# Altium schematic sheet bolid-iso-protium.SchDoc
size A3
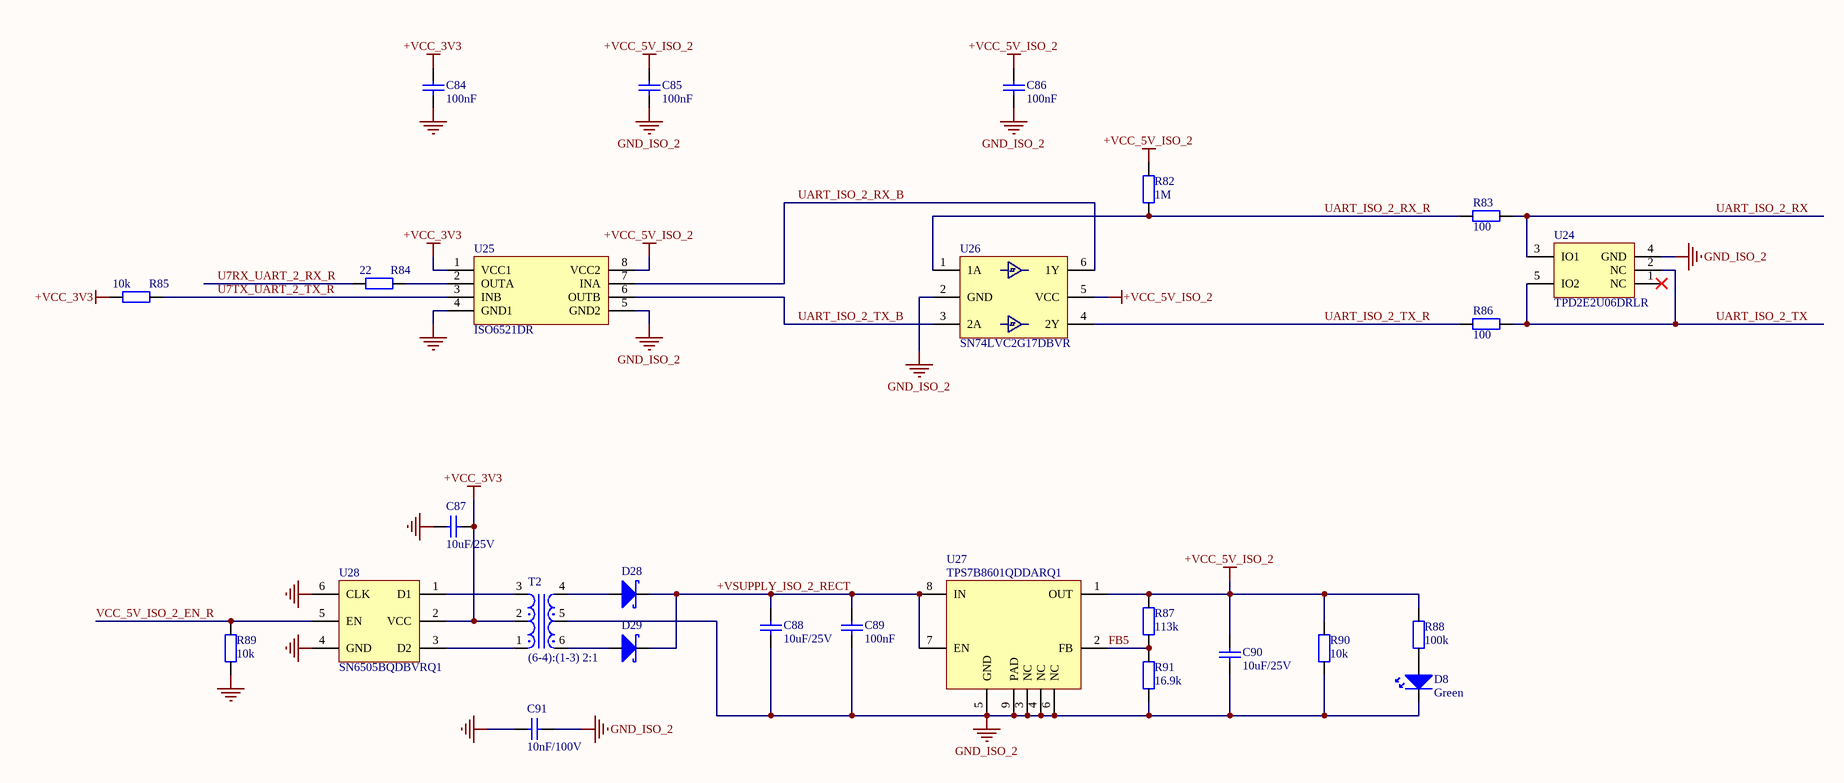
[diagram p0: bolid-iso-protium.SchDoc]

## Parts
C84  Value Displayed: 100nF  [C0402-CAPC100X50X55L22 - Tayio Yuden TDK]  (hidden comment: GRM155R71H104KE14D)
C85  Value Displayed: 100nF  [C0402-CAPC100X50X55L22 - Tayio Yuden TDK]  (hidden comment: GRM155R71H104KE14D)
C86  Value Displayed: 100nF  [C0402-CAPC100X50X55L22 - Tayio Yuden TDK]  (hidden comment: GRM155R71H104KE14D)
C87  Value Displayed: 10uF/25V  [C1206-CAPC320X160X190L65N - Murata]  (hidden comment: TMK316AB7106KL-T)
C88  Value Displayed: 10uF/25V  [C1206-CAPC320X160X190L65N - Murata]  (hidden comment: TMK316AB7106KL-T)
C89  Value Displayed: 100nF  [C0402-CAPC100X50X55L22 - Tayio Yuden TDK]  (hidden comment: GRM155R71H104KE14D)
C90  Value Displayed: 10uF/25V  [C1206-CAPC320X160X190L65N - Murata]  (hidden comment: TMK316AB7106KL-T)
C91  Value Displayed: 10nF/100V  [C0603-CAPC162X80X95L35N]  (hidden comment: GRM188R72A103KA01J)
D8  Illumination Color: Green  [D0603 DIONC166X84X36L42N Littelfuse]  (hidden comment: 150060GS75000)
D28  MBR0530T3G  [SOD-123-2L SOD375X160X128L32X60N - Fairchild]  (value not drawn)
D29  MBR0530T3G  [SOD-123-2L SOD375X160X128L32X60N - Fairchild]  (value not drawn)
R82  value 1M  [R0402-RESC100X50X40L22N]  (hidden comment: AC0402FR-071ML)
R83  value 100  [R0402-RESC100X50X40L22N]  (hidden comment: RC0402FR-07100RL)
R84  value 22  [R0402-RESC100X50X40L22N]  (hidden comment: RC0402FR-1322RL)
R85  value 10k  [R0402-RESC100X50X40L22N]  (hidden comment: RC0402FR-0710KL)
R86  value 100  [R0402-RESC100X50X40L22N]  (hidden comment: RC0402FR-07100RL)
R87  value 113k  [R0402-RESC100X50X40L22N]  (hidden comment: RC0402FR-07113KL)
R88  value 100k  [R0402-RESC100X50X40L22N]  (hidden comment: RC0402FR-07100KL)
R89  value 10k  [R0402-RESC100X50X40L22N]  (hidden comment: RC0402FR-0710KL)
R90  value 10k  [R0402-RESC100X50X40L22N]  (hidden comment: RC0402FR-0710KL)
R91  value 16.9k  [R0402-RESC100X50X40L22N]  (hidden comment: RC0402FR-0716K9L)
T2  value (6-4):(1-3) 2:1  [WE 760390014]  (hidden comment: 760390015)
U24  TPD2E2U06DRLR  [TI SOT-5X3 DRL0005A SOTFL50P160X60-5N]
U25  ISO6521DR  [TI SOIC8 D0008A SOIC8P127_490X599X175L84X41N]
U26  SN74LVC2G17DBVR  [TI SOT23 DBV0006A SOT23-6P95_280X145L45X37N]
U27  TPS7B8601QDDARQ1  [TI SOIC8 DDA0008E-C01 SOIC127P600X170_HS-9N]
U28  SN6505BQDBVRQ1  [TI SOT23 DBV0006A SOT23-6P95_280X145L45X37N]

## Nets
+VCC_3V3: C84.2 C87.2 R85.2 T2.2 U25.1(VCC1) U28.2(VCC)
+VCC_5V_ISO_2: C85.2 C86.2 C90.2 R82.2 R87.2 R88.2 R90.2 U25.8(VCC2) U26.5(VCC) U27.1(OUT)
GND: C84.1 C87.1 C91.1 R89.1 U25.4(GND1) U28.4(GND) U28.6(CLK)
GND_ISO_2: C85.1 C86.1 C88.1 C89.1 C90.1 C91.2 D8.1(K) R90.1 R91.1 T2.5 U24.4(GND) U25.5(GND2) U26.2(GND) U27.3(NC) U27.4(NC) U27.5(GND) U27.6(NC) U27.9(PAD)
+VSUPPLY_ISO_2_RECT: C88.2 C89.2 D28.1(K) D29.1(K) U27.7(EN) U27.8(IN)
FB5: R87.1 R91.2 U27.2(FB)
U7RX_UART_2_RX_R: R84.1
U7TX_UART_2_TX_R: R85.1 U25.3(INB)
UART_ISO_2_RX: R83.2 U24.3(IO1)
UART_ISO_2_RX_B: U25.7(INA) U26.6(1Y)
UART_ISO_2_RX_R: R82.1 R83.1 U26.1(1A)
UART_ISO_2_TX: R86.2 U24.2(NC) U24.5(IO2)
UART_ISO_2_TX_B: U25.6(OUTB) U26.3(2A)
UART_ISO_2_TX_R: R86.1 U26.4(2Y)
VCC_5V_ISO_2_EN_R: R89.2 U28.5(EN)
NetD8_2: D8.2(A) R88.1
NetD28_2: D28.2(A) T2.4
NetD29_2: D29.2(A) T2.6
NetR84_2: R84.2 U25.2(OUTA)
NetT2_1: T2.1 U28.3(D2)
NetT2_3: T2.3 U28.1(D1)

Not connected (* = marked no-connect by the designer): U24 1(NC)*

## Library data of the parts
C84-C86 C89 = GRM155R71H104KE14D: MLCC 0402 (1005) 100nF 10% 50V X7R; Manufacturer: Murata Electronics; Capacitance: 0.1 uF; Type: Chip Multilayer Ceramic Capacitor for General Purpose; Voltage Rating DC: 50 VDC; Capacitance - pF: 100000 pF; Class: Class 2; Supplier 1: Mouser; Manufacturer Part Number: GRM155R71H104KE14D; RoHS: RoHS Compliant; Category: Multilayer Ceramic Capacitors MLCC - SMD/SMT; Stock 1: 3511637; Pricing 1: 1=0.090, 10=0.038, 100=0.016, 500=0.012, 1000=0.009, 2500=0.008, 5000=0.007, 10000=0.005 (EUR); Height: 0.5 mm; Length: 1 mm; Package / Case: 0402 (1005 metric); Packaging: Cut Tape; Product: General Type MLCCs; Series: GRM; Termination Style: SMD/SMT; Tolerance: 10 %; Width: 0.5 mm; Brand: Murata Electronics; Capacitance - nF: 100 nF; Case Code - in: 0402; Case Code - mm: 1005; Dielectric: X7R; Maximum Operating Temperature: + 125 C; Minimum Operating Temperature: - 55 C; Product Type: Ceramic Capacitors; Standard Pack Qty: 10000; Subcategory: Capacitors; Termination: Standard; RoHS - Mouser: Y; Minimum Order Quantity: 1; Reeling: True; ComponentLink1URL: https://www.mouser.com/datasheet/2/281/murata_03052018_GRM_Series_1-1310166.pdf; ComponentLink1Description: https://www.mouser.com/datasheet/2/281/murata_03052018_GRM_Series_1-1310166.pdf; Value: 100nF; Supplier Part Number 1: 81-GRM155R71H104KE4D
C87 C88 C90 = TMK316AB7106KL-T: MLCC 1206 (3216) 10uF 10% 25V X7R; Manufacturer: Taiyo Yuden; Type: General Purpose; Voltage Rating DC: 25 VDC; Class: Class 2; Value: 10u; Supplier 1: Mouser; Manufacturer Part Number: TMK316AB7106KL-T; RoHS: RoHS Compliant; Category: Multilayer Ceramic Capacitors MLCC - SMD/SMT; Stock 1: 162457; Pricing 1: 1=0.288, 10=0.130, 100=0.087, 500=0.077, 1000=0.068, 2000=0.056 (EUR); Capacitance: 10 uF; Diameter: -; Height: 1.6 mm; Length: 3.2 mm; Package / Case: 1206 (3216 metric); Packaging: Cut Tape; Product: General Type MLCCs; Series: M; Termination Style: SMD/SMT; Tolerance: 10 %; Width: 1.6 mm; Brand: Taiyo Yuden; Case Code - in: 1206; Case Code - mm: 3216; Dielectric: X7R; Maximum Operating Temperature: + 125 C; Minimum Operating Temperature: - 55 C; Product Type: Ceramic Capacitors; Standard Pack Qty: 2000; Subcategory: Capacitors; Termination: Standard; RoHS - Mouser: Y; Minimum Order Quantity: 1; Reeling: True; ComponentLink1URL: https://www.mouser.com/datasheet/2/396/mlcc02_e-1307760.pdf; ComponentLink1Description: https://www.mouser.com/datasheet/2/396/mlcc02_e-1307760.pdf; Supplier Part Number 1: 963-TMK316AB7106KL-T
C91 = GRM188R72A103KA01J: MLCC 0603 (1608) 10nF 10% 100V X7R; Manufacturer: Murata Electronics; Capacitance: 0.01 uF; Type: Chip Multilayer Ceramic Capacitor for General Purpose; Voltage Rating DC: 100 VDC; Capacitance - pF: 10000 pF; Class: Class 2; Value: 10n; Supplier 1: Mouser; Manufacturer Part Number: GRM188R72A103KA01J; RoHS: RoHS Compliant; Category: Multilayer Ceramic Capacitors MLCC - SMD/SMT; Stock 1: 161253; Pricing 1: 1=0.085, 10=0.049, 100=0.021, 500=0.015, 1000=0.011, 5000=0.010, 10000=0.008, 20000=0.007 (EUR); Height: 0.8 mm; Length: 1.6 mm; Package / Case: 0603 (1608 metric); Packaging: Cut Tape; Product: General Type MLCCs; Series: GRM; Termination Style: SMD/SMT; Tolerance: 10 %; Width: 0.8 mm; Brand: Murata Electronics; Capacitance - nF: 10 nF; Case Code - in: 0603; Case Code - mm: 1608; Dielectric: X7R; Maximum Operating Temperature: + 125 C; Minimum Operating Temperature: - 55 C; Product Type: Ceramic Capacitors; Standard Pack Qty: 10000; Subcategory: Capacitors; Termination: Standard; RoHS - Mouser: Y; Minimum Order Quantity: 1; Reeling: True; ComponentLink1URL: https://www.mouser.com/datasheet/2/281/1/GRM188R72A103KA01_01A-1985966.pdf; ComponentLink1Description: https://www.mouser.com/datasheet/2/281/1/GRM188R72A103KA01_01A-1985966.pdf; Supplier Part Number 1: 81-GRM188R72A103KA1J
D8 = 150060GS75000: LED 0603 (1608) Green; Manufacturer: Wurth Elektronik; Lens Color/Style: Water Clear; Power Rating: 105 mW; Lens Shape: Rectangular; Luminous Intensity: 430 mcd; Peak Wavelength: 515 nm; Viewing Angle: 140 deg; If - Forward Current: 20 mA; Vf - Forward Voltage: 3.2 V; Vr - Reverse Voltage: 5 V; Wavelength/Color Temperature: 520 nm; Supplier 1: Mouser; Manufacturer Part Number: 150060GS75000; RoHS: RoHS Compliant; Category: Standard LEDs - SMD; Stock 1: 17312; Pricing 1: 1=0.130, 10=0.126, 50=0.115, 100=0.099, 500=0.085, 4000=0.085 (EUR); Height: 0.7 mm; Length: 1.6 mm; Package / Case: 0603 (1608 metric); Packaging: Cut Tape; Product: Green LEDs; Series: WL-SMCW; Width: 0.8 mm; Brand: Wurth Elektronik; Mounting Style: SMD/SMT; Lens Dimensions: 1.1 mm x 0.8 mm; Lens Transparency: Water Clear; Maximum Operating Temperature: + 85 C; Minimum Operating Temperature: - 40 C; Moisture Sensitive: Yes; Product Type: LED - Standard; Standard Pack Qty: 4000; Subcategory: LEDs; RoHS - Mouser: Y; Minimum Order Quantity: 1; Reeling: True; ComponentLink1URL: https://www.mouser.com/datasheet/2/445/150060GS75000-368921.pdf; ComponentLink1Description: https://www.mouser.com/datasheet/2/445/150060GS75000-368921.pdf; Supplier Part Number 1: 710-150060GS75000
D28 D29 = MBR0530T3G: ON Semi MBR0530T3G; SMT Schottky Diode; 30V 500mA; 2-Pin SOD-123; Manufacturer: ON Semiconductor; Supplier 1: Mouser; Manufacturer Part Number: MBR0530T3G; RoHS: Yes; Category: Schottky Diodes; Stock 1: 167531; Pricing 1: 1=0,19, 10=0,126, 50=0,126, 100=0,065, 1000=0,053, 10000=0,041 (USD); ComponentLink1URL: https://datasheet.ciiva.com/6381/mbr0530t1-d-6381904.pdf?src-supplier=Digikey; ComponentLink1Description: https://datasheet.ciiva.com/6381/mbr0530t1-d-6381904.pdf?src-supplier=Digikey; ComponentLink2URL: https://datasheet.ciiva.com/7962/85890-7962703.pdf?src-supplier=Element14; ComponentLink2Description: https://datasheet.ciiva.com/7962/85890-7962703.pdf?src-supplier=Element14; ComponentLink3URL: https://datasheet.ciiva.com/8294/mbr0530t1-d-8294572.pdf?src-supplier=Avnet; ComponentLink3Description: https://datasheet.ciiva.com/8294/mbr0530t1-d-8294572.pdf?src-supplier=Avnet; ComponentLink4URL: https://datasheet.ciiva.com/15144/getdatasheetpartid-86762-15144599.pdf?src-supplier=Verical; ComponentLink4Description: https://datasheet.ciiva.com/15144/getdatasheetpartid-86762-15144599.pdf?src-supplier=Verical; ComponentLink5URL: https://datasheet.ciiva.com/6381/mbr0530t1-d-6381902.pdf?src-supplier=Digikey; ComponentLink5Description: https://datasheet.ciiva.com/6381/mbr0530t1-d-6381902.pdf?src-supplier=Digikey; Supplier Part Number 1: 863-MBR0530T3G
R82 = AC0402FR-071ML: RES 0402 (1005) 1.00M 1% 0.0625W 50V Thick Film; Manufacturer: YAGEO; Power Rating: 62.5 mW (1/16 W); Resistance: 1 MOhms; Temperature Coefficient: 100 PPM / C; Qualification: AEC-Q200; Supplier 1: Mouser; Manufacturer Part Number: AC0402FR-071ML; RoHS: RoHS Compliant By Exemption; Category: Thick Film Resistors - SMD; Stock 1: 142366; Pricing 1: 1=0.085, 10=0.019, 100=0.008, 1000=0.004, 2500=0.003, 10000=0.003 (EUR); Application: Automotive Grade; Height: 0.32 mm; Length: 1 mm; Packaging: Cut Tape; Product: Thick Film Resistors General Purpose; Series: AC; Technology: Thick Film; Termination Style: SMD/SMT; Tolerance: 1 %; Type: General Purpose Resistor; Voltage Rating: 50 V; Width: 0.5 mm; Brand: YAGEO; Mounting Style: PCB Mount; Case Code - in: 0402; Case Code - mm: 1005; Maximum Operating Temperature: + 155 C; Minimum Operating Temperature: - 55 C; Product Type: Thick Film Resistors; Standard Pack Qty: 10000; Subcategory: Resistors; RoHS - Mouser: E; Minimum Order Quantity: 1; Reeling: True; ComponentLink1URL: https://www.mouser.com/datasheet/2/447/Yageo_PYu_AC_51_RoHS_L_7_1714230-1874691.pdf; ComponentLink1Description: https://www.mouser.com/datasheet/2/447/Yageo_PYu_AC_51_RoHS_L_7_1714230-1874691.pdf; Supplier Part Number 1: 603-AC0402FR-071ML
R83 R86 = RC0402FR-07100RL: RES 0402 (1005) 100.0 ohm 1% 0.0625W 50V Thick Film; Manufacturer: Yageo; Power Rating: 62.5 mW, 125 mW; Resistance: 100 Ohms; Temperature Coefficient: 100 PPM / C; Supplier 1: Mouser; Manufacturer Part Number: RC0402FR-07100RL; RoHS: RoHS Compliant; Category: Thick Film Resistors - SMD; Stock 1: 3714956; Pricing 1: 1=0.090, 10=0.011, 100=0.004, 1000=0.003, 10000=0.003 (EUR); Application: High Reliability; Features: -; Height: 0.35 mm; Length: 1 mm; Package / Case: -; Packaging: Cut Tape; Product: Thick Film Resistors SMD; Series: RC; Technology: Thick Film; Termination Style: SMD/SMT; Tolerance: 1 %; Type: General Purpose; Voltage Rating: 50 V; Width: 0.5 mm; Brand: Yageo; Mounting Style: PCB Mount; Case Code - in: 0402; Case Code - mm: 1005; Maximum Operating Temperature: + 155 C; Minimum Operating Temperature: - 55 C; Product Type: Thick Film Resistors; Standard Pack Qty: 10000; Subcategory: Resistors; RoHS - Mouser: Y; Minimum Order Quantity: 1; Reeling: True; ComponentLink1URL: https://www.mouser.com/datasheet/2/447/PYu-RC_Group_51_RoHS_L_10-1664068.pdf; ComponentLink1Description: https://www.mouser.com/datasheet/2/447/PYu-RC_Group_51_RoHS_L_10-1664068.pdf; Supplier Part Number 1: 603-RC0402FR-07100RL
R84 = RC0402FR-1322RL: RES 0402 (1005) 22.0 ohm 1% 0.0625W 50V Thick Film; Manufacturer: Yageo; Resistance: 22R; Power Rating: 62.5mW; Temperature Coefficient: 100ppm/°C; Supplier 1: Mouser; Manufacturer Part Number: RC0402FR-1322RL; RoHS: Yes; Category: Chip SMD Resistors; Stock 1: 130563; Pricing 1: 1=0,10000, 10=0,01200, 50=0,01200, 100=0,00500, 1000=0,00300, 10000=0,00300 (USD); Case/Package: 0402; Case Code (Imperial): 0402; Case Code (Metric): 1005; Weight: 2.3E-05oz; Contact Plating: Tin,Matte; Size Code: 0402; Min Operating Temperature: -55°C; Max Operating Temperature: 155°C; Voltage Rating: 50V; Tolerance: 1%; Packaging: Tape and Reel; Resistor Type: Thick Film; Termination: SMD/SMT; Series: RC; Length: 1mm; Width: 0.5mm; Height: 0.35mm; Radiation Hardening: No; Lead Free: Lead Free; RoHS Compliant: Yes; ComponentLink1URL: https://datasheet.ciiva.com/17423/pyu-rc0402-51-rohs-l-6-r-17423721.pdf?src-supplier=Future+Electronics; ComponentLink1Description: https://datasheet.ciiva.com/17423/pyu-rc0402-51-rohs-l-6-r-17423721.pdf?src-supplier=Future+Electronics; ComponentLink2URL: https://datasheet.ciiva.com/8890/pyu-rc0402-51-rohs-l-6-8890187.pdf?src-supplier=Avnet; ComponentLink2Description: https://datasheet.ciiva.com/8890/pyu-rc0402-51-rohs-l-6-8890187.pdf?src-supplier=Avnet; Supplier Part Number 1: 603-RC0402FR-1322RL
R85 R89 R90 = RC0402FR-0710KL: RES 0402 (1005) 10.0k 1% 0.0625W 50V Thick Film; Manufacturer: Yageo; Power Rating: 62.5 mW, 125 mW; Resistance: 10 kOhms; Temperature Coefficient: 100 PPM / C; Supplier 1: Mouser; Manufacturer Part Number: RC0402FR-0710KL; RoHS: RoHS Compliant; Category: Thick Film Resistors - SMD; Stock 1: 20942447; Pricing 1: 1=0.090, 10=0.011, 100=0.004, 1000=0.003, 10000=0.003 (EUR); Application: High Reliability; Features: -; Height: 0.35 mm; Length: 1 mm; Package / Case: -; Packaging: Cut Tape; Product: Thick Film Resistors SMD; Series: RC; Technology: Thick Film; Termination Style: SMD/SMT; Tolerance: 1 %; Type: General Purpose; Voltage Rating: 50 V; Width: 0.5 mm; Brand: Yageo; Mounting Style: PCB Mount; Case Code - in: 0402; Case Code - mm: 1005; Maximum Operating Temperature: + 155 C; Minimum Operating Temperature: - 55 C; Product Type: Thick Film Resistors; Standard Pack Qty: 10000; Subcategory: Resistors; RoHS - Mouser: Y; Minimum Order Quantity: 1; Reeling: True; ComponentLink1URL: https://www.mouser.com/datasheet/2/447/PYu-RC_Group_51_RoHS_L_10-1664068.pdf; ComponentLink1Description: https://www.mouser.com/datasheet/2/447/PYu-RC_Group_51_RoHS_L_10-1664068.pdf; Supplier Part Number 1: 603-RC0402FR-0710KL
R87 = RC0402FR-07113KL: RES 0402 (1005) 113.0k 1% 0.0625W 50V Thick Film; Manufacturer: Yageo; Supplier 1: Mouser; Manufacturer Part Number: RC0402FR-07113KL; RoHS: Yes; Category: Chip SMD Resistors; Stock 1: 42603; Pricing 1: 1=0,1, 10=0,007, 50=0,007, 100=0,004, 1000=0,003, 10000=0,002 (USD); Voltage Rating (DC): 50V; Lead Free: 5697LeadFree; ComponentLink1URL: https://datasheet.ciiva.com/16744/pyu-rc0402-51-rohs-l-6-r-16744521.pdf?src-supplier=Future+Electronics; ComponentLink1Description: https://datasheet.ciiva.com/16744/pyu-rc0402-51-rohs-l-6-r-16744521.pdf?src-supplier=Future+Electronics; ComponentLink2URL: https://datasheet.ciiva.com/2452/pyu-r-int-thick-7-2452604.pdf?src-supplier=Digikey; ComponentLink2Description: https://datasheet.ciiva.com/2452/pyu-r-int-thick-7-2452604.pdf?src-supplier=Digikey; Supplier Part Number 1: 603-RC0402FR-07113KL
R88 = RC0402FR-07100KL: RES 0402 (1005) 100.0k 1% 0.0625W 50V Thick Film; Manufacturer: Yageo; Power Rating: 62.5 mW, 125 mW; Resistance: 100 kOhms; Temperature Coefficient: 100 PPM / C; Supplier 1: Mouser; Manufacturer Part Number: RC0402FR-07100KL; RoHS: RoHS Compliant; Category: Thick Film Resistors - SMD; Stock 1: 2491111; Pricing 1: 1=0.090, 10=0.011, 100=0.004, 1000=0.003, 10000=0.003 (EUR); Application: High Reliability; Features: -; Height: 0.35 mm; Length: 1 mm; Package / Case: -; Packaging: Cut Tape; Product: Thick Film Resistors SMD; Series: RC; Technology: Thick Film; Termination Style: SMD/SMT; Tolerance: 1 %; Type: General Purpose; Voltage Rating: 50 V; Width: 0.5 mm; Brand: Yageo; Mounting Style: PCB Mount; Case Code - in: 0402; Case Code - mm: 1005; Maximum Operating Temperature: + 155 C; Minimum Operating Temperature: - 55 C; Product Type: Thick Film Resistors; Standard Pack Qty: 10000; Subcategory: Resistors; RoHS - Mouser: Y; Minimum Order Quantity: 1; Reeling: True; ComponentLink1URL: https://www.mouser.com/datasheet/2/447/PYu-RC_Group_51_RoHS_L_10-1664068.pdf; ComponentLink1Description: https://www.mouser.com/datasheet/2/447/PYu-RC_Group_51_RoHS_L_10-1664068.pdf; Supplier Part Number 1: 603-RC0402FR-07100KL
R91 = RC0402FR-0716K9L: RES 0402 (1005) 16.9k 1% 0.0625W 50V Thick Film; Manufacturer: Yageo; Resistance: 16.9kR; Power Rating: 62.5mW; Max Power Dissipation: 63mW; Temperature Coefficient: 100ppm/°C; Supplier 1: Mouser; Manufacturer Part Number: RC0402FR-0716K9L; RoHS: Yes; Category: Chip SMD Resistors; Stock 1: 109384; Pricing 1: 1=0,1, 10=0,008, 50=0,008, 100=0,005, 1000=0,005, 10000=0,002 (USD); Case/Package: 0402; Case Code (Imperial): 0402; Case Code (Metric): 1005; Contact Plating: Tin,Matte; Size Code: 0402; Min Operating Temperature: -55°C; Max Operating Temperature: 155°C; Package Quantity: 10000; Tolerance: 1%; Voltage Rating: 50V; Packaging: Tape and Reel; Number of Terminations: 2; Termination: SMD/SMT; Voltage Rating (DC): 50V; Features: Moisture Resistant; Series: RC; Length: 0.039inch; Width: 0.5mm; Height: 0.016inch; Lead Free: Lead Free; RoHS Compliant: Yes; ComponentLink1URL: https://datasheet.ciiva.com/12561/pyu-rc0402-51-rohs-l-6-r-8721-12561757.pdf?src-supplier=Mouser; ComponentLink1Description: https://datasheet.ciiva.com/12561/pyu-rc0402-51-rohs-l-6-r-8721-12561757.pdf?src-supplier=Mouser; ComponentLink2URL: https://datasheet.ciiva.com/17073/pyu-rc0402-51-rohs-l-6-r-17073310.pdf?src-supplier=Future+Electronics; ComponentLink2Description: https://datasheet.ciiva.com/17073/pyu-rc0402-51-rohs-l-6-r-17073310.pdf?src-supplier=Future+Electronics; Supplier Part Number 1: 603-RC0402FR-0716K9L
T2 = 760390015: Transformer 2:1 11VuS 150mAAC Power Transformers MID-SN6501 TI Driver Toroid .475mH 3.3VDC; Manufacturer: Wurth Elektronik / Midcom; Inductance: 475 uH; Operating Frequency: 250 kHz to 550 kHz; Power Rating: 1.8 W; Turns Ratio: 0.043055556; Type: Push-Pull; Primary Voltage Rating: 3.3 V; Secondary Current Rating: 350 mA; Secondary Voltage Rating: 5 V; Primary Winding: Dual Primary Winding; Secondary Winding: Dual Secondary Winding; Voltage Time - Et: 11 uVs; Supplier 1: Mouser; Manufacturer Part Number: 760390015; RoHS: RoHS Compliant; Category: Power Transformers; Stock 1: 4102; Pricing 1: 1=1.90, 10=1.71, 50=1.55, 100=1.42, 500=1.34, 1200=1.34 (EUR); Height: 4.19 mm; Length: 6.73 mm; Operating Temperature Range: - 40 C to + 125 C; Packaging: Cut Tape; Product: Power; Series: MID-PPTI; Termination Style: SMD/SMT; Width: 10.05 mm; Brand: Wurth Elektronik / Midcom; Mounting Style: SMD/SMT; Maximum Operating Temperature: + 125 C; Minimum Operating Temperature: - 40 C; Product Type: Audio & Signal Transformers; Standard Pack Qty: 1200; Subcategory: Transformers; RoHS - Mouser: Y; Minimum Order Quantity: 1; Reeling: True; ComponentLink1URL: https://www.mouser.com/datasheet/2/445/760390015-221218.pdf; ComponentLink1Description: https://www.mouser.com/datasheet/2/445/760390015-221218.pdf; Supplier Part Number 1: 710-760390015
U24 = TPD2E2U06DRLR: TVS DIODE 5.5VWM 12.4VC 5SOT; Manufacturer: Texas Instruments; Direction: Unidirectional; Capacitance: 1.9pF; Reverse Standoff Voltage: 5.5V; Min Breakdown Voltage: 6.5V; Clamping Voltage: 12.4V; Peak Pulse Power: 85W; Power Line Protection: Yes; Breakdown Voltage: 8.5V; Peak Pulse Current: 5.5A; Number of Channels: 2; Interface: LVDS,USB,Ethernet; Supplier 1: Mouser; Manufacturer Part Number: TPD2E2U06DRLR; RoHS: Yes; Category: Integrated Circuits (ICs); Stock 1: 73856; Pricing 1: 1=0,49, 10=0,356, 50=0,356, 100=0,254, 1000=0,173, 10000=0,159 (USD); Mount: Surface Mount; Case/Package: SOT-5; Number of Pins: 5; Min Operating Temperature: -40°C; Max Operating Temperature: 125°C; Packaging: Tape and Reel; Working Voltage: 5.5V; Polarity: Unidirectional; Termination: SMD/SMT; Package Quantity: 4000; Series: -; Operating Supply Voltage: 5.5V; Number of Unidirectional Channels: 2; Lead Free: Lead Free; RoHS Compliant: Yes; Reach SVHC Compliant: No; ComponentLink1URL: https://datasheet.ciiva.com/48533/tpd2e2u06-48533343.pdf?src-supplier=Avnet; ComponentLink1Description: https://datasheet.ciiva.com/48533/tpd2e2u06-48533343.pdf?src-supplier=Avnet; Supplier Part Number 1: 595-TPD2E2U06DRLR
U25 = ISO6521DR: Functional isolation dual-channel 1/1 digital isolator 8-SOIC -40 to 125; Manufacturer: Texas Instruments; Supplier 1: Mouser; Manufacturer Part Number: ISO6521DR; RoHS: No; Stock 1: 2524; Pricing 1: 1=1,38, 10=0,862, 50=0,862, 100=0,695, 1000=0,635, 10000=0,549 (USD); Case/Package: SOIC; Number of Pins: 8; Length: 4.9mm; Width: 3.91mm; Height: 1.75mm; Thickness: 1.58mm; Supplier Part Number 1: 595-ISO6521DR
U26 = SN74LVC2G17DBVR: 2-ch, 1.65-V to 5.5-V buffers with Schmitt-Trigger inputs 6-SOT-23 -40 to 125; Manufacturer: Texas Instruments; Number of Channels: 2; Max Supply Voltage: 5.5V; Min Supply Voltage: 1.65V; Propagation Delay: 4.3ns; Logic Function: Schmitt Trigger,Buffer; Low Level Output Current: 32mA; Polarity: Non-Inverting; Number of Bits per Element: 1; High Level Output Current: -32mA; Turn-On Delay Time: 9.3ns; Quiescent Current: 10uA; Nominal Supply Current: 250mA; Supplier 1: Mouser; Manufacturer Part Number: SN74LVC2G17DBVR; RoHS: Yes; Category: Buffers, Drivers and Transceivers; Stock 1: 195310; Pricing 1: 1=0,17, 10=0,094, 50=0,094, 100=0,063, 1000=0,062, 10000=0,051 (USD); Mount: Surface Mount; Case/Package: SOT-23; Number of Pins: 6; Min Operating Temperature: -40°C; Max Operating Temperature: 125°C; Number of Inputs: 2; Number of Outputs: 2; Packaging: Tape and Reel; Package Quantity: 1; Number of Elements: 2; Number of Input Lines: 2; Number of Output Lines: 2; Termination: SMD/SMT; Number of Gates: 2; Number of Bits: 2; Series: 74LVC; Technology: CMOS; Length: 2.9mm; Width: 1.6mm; Thickness: 1.2mm; Radiation Hardening: No; Reach SVHC Compliant: No; Lead Free: Lead Free; RoHS Compliant: Yes; ComponentLink1URL: https://datasheet.ciiva.com/23943/1772447-23943379.pdf?src-supplier=Newark; ComponentLink1Description: https://datasheet.ciiva.com/23943/1772447-23943379.pdf?src-supplier=Newark; ComponentLink2URL: https://datasheet.ciiva.com/34301/1046318-34301918.pdf?src-supplier=Jameco; ComponentLink2Description: https://datasheet.ciiva.com/34301/1046318-34301918.pdf?src-supplier=Jameco; ComponentLink3URL: https://datasheet.ciiva.com/7744/1781649-7744027.pdf?src-supplier=Element14; ComponentLink3Description: https://datasheet.ciiva.com/7744/1781649-7744027.pdf?src-supplier=Element14; ComponentLink4URL: https://datasheet.ciiva.com/7744/1781649-7744028.pdf?src-supplier=Element14; ComponentLink4Description: https://datasheet.ciiva.com/7744/1781649-7744028.pdf?src-supplier=Element14; ComponentLink5URL: https://datasheet.ciiva.com/28594/1772447-28594828.pdf?src-supplier=Element14; ComponentLink5Description: https://datasheet.ciiva.com/28594/1772447-28594828.pdf?src-supplier=Element14; ComponentLink6URL: https://datasheet.ciiva.com/46439/1857109-46439627.pdf?src-supplier=Element14; ComponentLink6Description: https://datasheet.ciiva.com/46439/1857109-46439627.pdf?src-supplier=Element14; ComponentLink7URL: https://datasheet.ciiva.com/1833/sn74lvc2g17-1833740.pdf?src-supplier=Digikey; ComponentLink7Description: https://datasheet.ciiva.com/1833/sn74lvc2g17-1833740.pdf?src-supplier=Digikey; ComponentLink8URL: https://datasheet.ciiva.com/1833/sn74lvc2g17-1833739.pdf?src-supplier=Digikey; ComponentLink8Description: https://datasheet.ciiva.com/1833/sn74lvc2g17-1833739.pdf?src-supplier=Digikey; ComponentLink9URL: https://datasheet.ciiva.com/1833/sn74lvc2g17-1833741.pdf?src-supplier=Digikey; ComponentLink9Description: https://datasheet.ciiva.com/1833/sn74lvc2g17-1833741.pdf?src-supplier=Digikey; Supplier Part Number 1: 595-SN74LVC2G17DBVR
U27 = TPS7B8601QDDARQ1: Automotive 500-mA, 40-V, ultra-low-IQ, low-dropout (LDO) linear regulator with power good 8-SO PowerPAD -40 to 150; Manufacturer: Texas Instruments; Supplier 1: Mouser; Manufacturer Part Number: TPS7B8601QDDARQ1; RoHS: Yes; Category: Integrated Circuits (ICs); Stock 1: 7087; Pricing 1: 1=2,23, 10=1,45, 50=1,45, 100=1,28, 1000=1,09, 10000=1,02 (USD); RoHS Compliant: Yes; Supplier Part Number 1: 595-TPS7B8601QDDARQ1
U28 = SN6505BQDBVRQ1: Power Management Specialized - PMIC A 595-SN6505BQDBVTQ1; Manufacturer: Texas Instruments; Input Current: 1.56 mA; Output Current: 1 A; Input Voltage Range: 2.25 V to 5.5 V; Qualification: AEC-Q100; Product Status: New Product; Supplier 1: Mouser; Manufacturer Part Number: SN6505BQDBVRQ1; RoHS: RoHS Compliant; Category: Power Management Specialized - PMIC; Stock 1: 3000; Pricing 1: 1=2.42, 10=2.18, 100=1.78, 250=1.67, 500=1.51, 1000=1.28, 3000=1.22, 6000=1.19 (EUR); Package / Case: SOT-23-6; Packaging: Cut Tape; Product: PMICs; Series: SN6505B-Q1; Type: Low-EMI; Brand: Texas Instruments; Mounting Style: SMD/SMT; Maximum Operating Temperature: + 125 C; Minimum Operating Temperature: - 40 C; Moisture Sensitive: Yes; Operating Supply Current: 1.56 mA; Operating Supply Voltage: 2.25 V to 5.5 V; Product Type: Power Management Specialized - PMIC; Standard Pack Qty: 3000; Subcategory: PMIC - Power Management ICs; RoHS - Mouser: Y; Minimum Order Quantity: 1; Reeling: True; Supplier Part Number 1: 595-SN6505BQDBVRQ1